# Altium schematic sheet analog.SchDoc
size A3
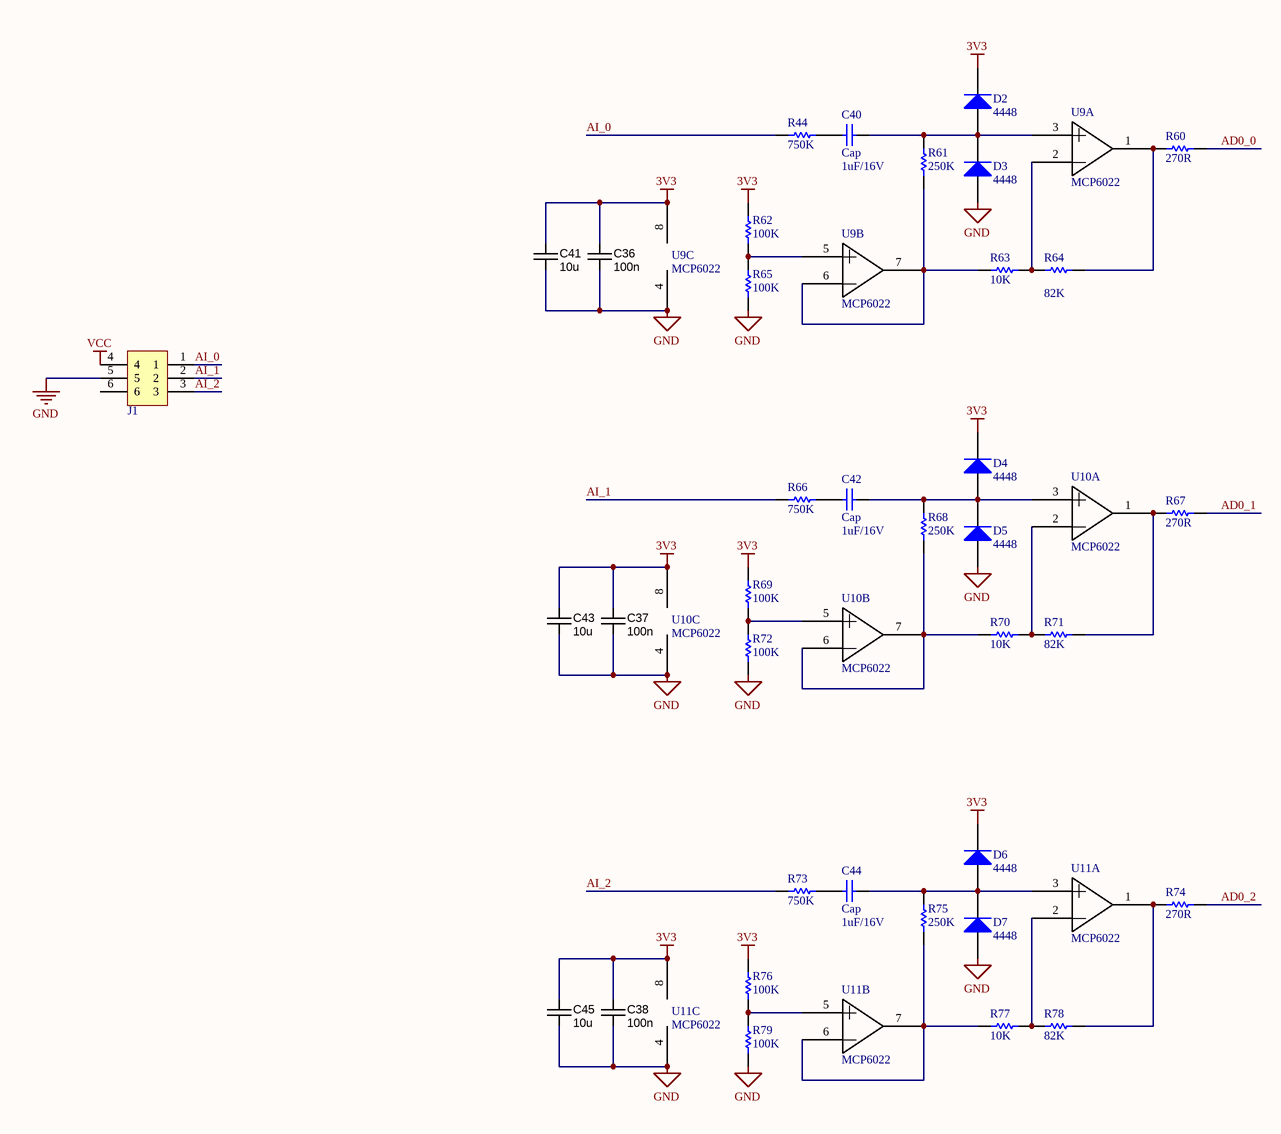
[diagram p0: analog.SchDoc]

## Parts
C36  100n  [CAPC1005L]
C37  100n  [CAPC1005L]
C38  100n  [CAPC1005L]
C40  Cap  value 1uF/16V  [CAPC1005L]
C41  10u  [CAPC2012N]
C42  Cap  value 1uF/16V  [CAPC1005L]
C43  10u  [CAPC2012N]
C44  Cap  value 1uF/16V  [CAPC1005L]
C45  10u  [CAPC2012N]
D2  4448  [SOD323]
D3  4448  [SOD323]
D4  4448  [SOD323]
D5  4448  [SOD323]
D6  4448  [SOD323]
D7  4448  [SOD323]
J1  2X6du pont-2.0mm-6line to 90der  [HDR2X3 - duplicate-6-line 90 der]  (value not drawn)
R44  750K  [RESC1005L]
R60  270R  [RESC1005L]
R61  250K  [RESC1005L]
R62  100K  [RESC1005L]
R63  10K  [RESC1005L]
R64  82K  [RESC1005L]
R65  100K  [RESC1005L]
R66  750K  [RESC1005L]
R67  270R  [RESC1005L]
R68  250K  [RESC1005L]
R69  100K  [RESC1005L]
R70  10K  [RESC1005L]
R71  82K  [RESC1005L]
R72  100K  [RESC1005L]
R73  750K  [RESC1005L]
R74  270R  [RESC1005L]
R75  250K  [RESC1005L]
R76  100K  [RESC1005L]
R77  10K  [RESC1005L]
R78  82K  [RESC1005L]
R79  100K  [RESC1005L]
U9  MCP6022  [TSSOP-ST8_N]  (parts A,B,C of 3)
U10  MCP6022  [TSSOP-ST8_N]  (parts A,B,C of 3)
U11  MCP6022  [TSSOP-ST8_N]  (parts A,B,C of 3)

## Nets
3V3: C36.1 C37.1 C38.1 C41.1 C43.1 C45.1 D2.2(K) D4.2(K) D6.2(K) R62.2 R69.2 R76.2 U9.8(VDD) U10.8(VDD) U11.8(VDD)
GND: C36.2 C37.2 C38.2 C41.2 C43.2 C45.2 D3.1(A) D5.1(A) D7.1(A) J1.5 R65.1 R72.1 R79.1 U9.4(GND) U10.4(GND) U11.4(GND)
VCC: J1.4
AD0_0: R60.2
AD0_1: R67.2
AD0_2: R74.2
AI_0: J1.1 R44.1
AI_1: J1.2 R66.1
AI_2: J1.3 R73.1
NetC40_1: C40.1 R44.2
NetC40_2: C40.2 D2.1(A) D3.2(K) R61.2 U9.3(VINA+)
NetC42_1: C42.1 R66.2
NetC42_2: C42.2 D4.1(A) D5.2(K) R68.2 U10.3(VINA+)
NetC44_1: C44.1 R73.2
NetC44_2: C44.2 D6.1(A) D7.2(K) R75.2 U11.3(VINA+)
NetR60_1: R60.1 R64.2 U9.1(VOUTA)
NetR61_1: R61.1 R63.1 U9.6(VINB-) U9.7(VOUTB)
NetR62_1: R62.1 R65.2 U9.5(VINB+)
NetR63_2: R63.2 R64.1 U9.2(VINA-)
NetR67_1: R67.1 R71.2 U10.1(VOUTA)
NetR68_1: R68.1 R70.1 U10.6(VINB-) U10.7(VOUTB)
NetR69_1: R69.1 R72.2 U10.5(VINB+)
NetR70_2: R70.2 R71.1 U10.2(VINA-)
NetR74_1: R74.1 R78.2 U11.1(VOUTA)
NetR75_1: R75.1 R77.1 U11.6(VINB-) U11.7(VOUTB)
NetR76_1: R76.1 R79.2 U11.5(VINB+)
NetR77_2: R77.2 R78.1 U11.2(VINA-)

Not connected (* = marked no-connect by the designer): J1 6

## Notes on the sheet
- Title
- Name
- Size:
- Revision:
- A3
- Date:
- Time:
- Sheet
- of

## Library data of the parts
C36-C38 C41 C43 C45 = CAPC_100n_0805: Capacitor SMD; Manufacturer 1: Kemet; Manufacturer Part Number 1: C0805C104K5RACTU; Tolerance: ?0%; Ratings: 50V; X7R; Material: ceramic; Package / Case: 0805 (2012 metric); Supplier 1: Digi-Key; Supplier Part Number 1: 399-1170-1-ND
  C36-C38: Value: 100n
  C41 C43 C45: Value: 10u
C40 C42 C44 = Cap: Capacitor SMD; Published: 8-Jun-2000; LatestRevisionDate: 17-Jul-2002; LatestRevisionNote: Re-released for DXP Platform.; PackageReference: RAD-0.3; Publisher: Altium Limited; PackageDescription: Radial Cap, Thru-Hole; 2 Leads; 0.3 in Pin Spacing
D2-D7 = Diode 1N4448: High Conductance Fast Diode; Published: 8-Jun-2000; LatestRevisionDate: 17-Jul-2002; LatestRevisionNote: Re-released for DXP Platform.; DatasheetVersion: 1997; PackageReference: DO-35; Publisher: Altium Limited; PackageDescription: Diode, Axial; Body 3.8 x 1.9 mm (LxDia. max), Lead Dia. 0.53 mm (max); Code_JEDEC: DO-204-AH; ComponentLink1Description: Manufacturer Link; ComponentLink1URL: http://www.fairchildsemi.com/; ComponentLink2Description: Datasheet; ComponentLink2URL: http://www.fairchildsemi.com/ds/1N%2F1N4448.pdf
R44 R60-R79 = Res1: Resistor SMD; Published: 8-Jun-2000; LatestRevisionDate: 17-Jul-2002; LatestRevisionNote: Re-released for DXP Platform.; PackageReference: AXIAL-0.3; Publisher: Altium Limited; PackageDescription: Axial Device, Thru-Hole; 2 Leads; 0.3 in Pin Spacing
  R44 R66 R73: Value: 750K
  R60 R67 R74: Value: 270R
  R61 R68 R75: Value: 250K
  R62 R65 R69 R72 R76 R79: Value: 100K
  R63 R70 R77: Value: 10K
  R64 R71 R78: Value: 82K